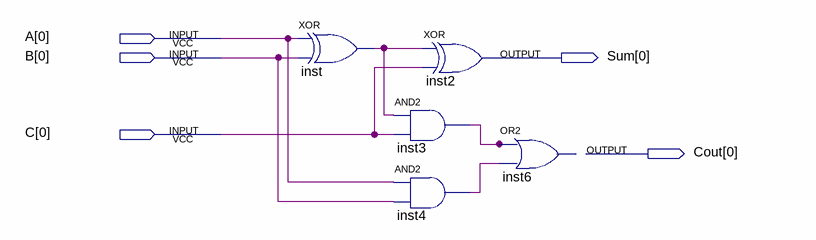
[diagram p0: schematic sheet]
// Quartus schematic Add1.bdf as structural Verilog: 5 symbols, 5 pins
module Add1 (
  input  [0:0] A,
  input  [0:0] B,
  input  [0:0] C,
  output [0:0] Sum,
  output [0:0] Cout
);

  wire inst3_out, inst4_out, inst_out;

  xor inst (inst_out, A[0], B[0]);
  xor inst2 (Sum[0], inst_out, C[0]);
  and inst3 (inst3_out, inst_out, C[0]);
  and inst4 (inst4_out, A[0], B[0]);
  // OR2 inst6 has open pins: IN1=inst3_out, IN2=inst4_out, OUT=open
endmodule
